# EAGLE design ESP03_Breakout (EAGLE 7.1.0)
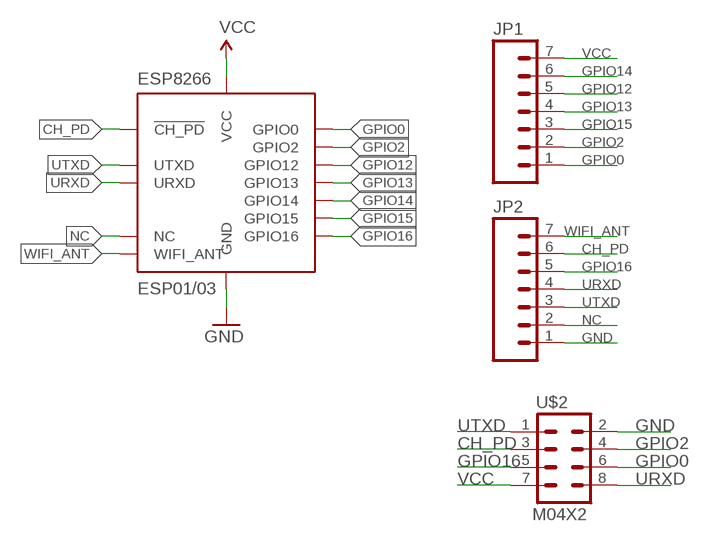
[diagram p0: schematic, sheet 1]

## Parts
ESP8266  ESP01/03  ESP-03SMD  [ESP-03]
JP1  M07  [1X07]
JP2  M07  [1X07]
U$2  M04X2  [2X4]

## Nets
CH_PD: ESP8266.CH_PD(!CH_PD) JP2.6 U$2.3
GND: ESP8266.GND JP2.1 U$2.2
GPIO0: ESP8266.GPIO0 JP1.1 U$2.6
GPIO2: ESP8266.GPIO2 JP1.2 U$2.4
GPIO12: ESP8266.GPIO12 JP1.5
GPIO13: ESP8266.GPIO13 JP1.4
GPIO14: ESP8266.GPIO14 JP1.6
GPIO15: ESP8266.GPIO15 JP1.3
GPIO16: ESP8266.GPIO16 JP2.5 U$2.5
NC: ESP8266.NC JP2.2
URXD: ESP8266.URXD JP2.4 U$2.8
UTXD: ESP8266.UTXD JP2.3 U$2.1
VCC: ESP8266.VCC JP1.7 U$2.7
WIFI_ANT: ESP8266.WIFI_ANT JP2.7

## Library data of the parts
ESP8266 = ESP8266:ESP-03: ESP-03 SMD package with built-in ceramic antenna. All available IOs.
JP1 JP2 = SparkFun-Connectors:M07: Header 7 Standard 7-pin 0.1" header. Use with straight break away headers (SKU : PRT-00116), right angle break away headers (PRT-00553), swiss pins (PRT-00743), machine pins (PRT-00117), and female headers (PRT-00115). NOTES ON THE VARIANTS LOCK and LOCK_LONGPADS... This footprint was designed to help hold the alignment of a through-hole component (i.e. 7-pin header) while soldering it into place. You may notice that each hole has been shifted either up or down by 0.005 of an inch from it's more standard position (which is usually a perfectly straight line). This slight alteration caused the pins (the squares in the middle) to touch the edges of the holes. Because they are alternating, it causes a "brace" to hold the header in place. 0.005 has proven to be the perfect amount of "off-center" position when using our standard breakaway headers. Although looks a little odd when you look at the bare footprint, once you have a header in there, the alteration is very hard to notice. Also, if you push a header all the way into place, it is covered up entirely on the bottom side. This idea of altering the position of holes to aid alignment will be further integrated into the Sparkfun Library for other footprints. It can help hold any component with 3 or more connection pins.
U$2 = SparkFun-Connectors:M04X2: .1" header, two rows of four.

## Board
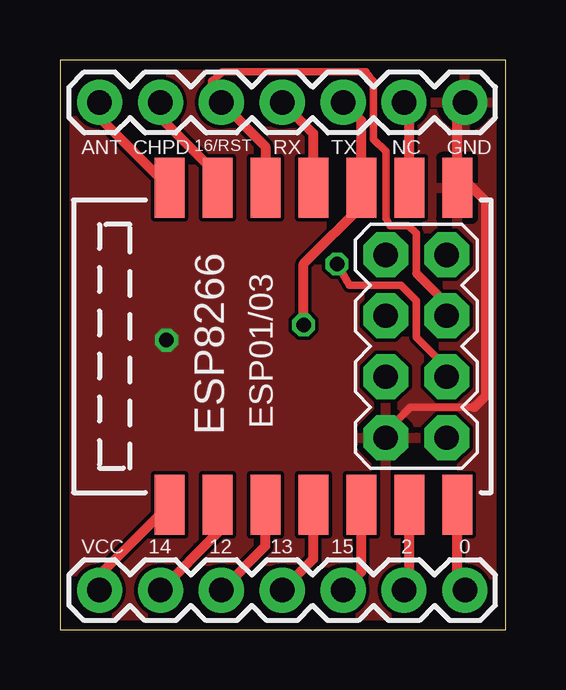
[diagram p1: board, top side]
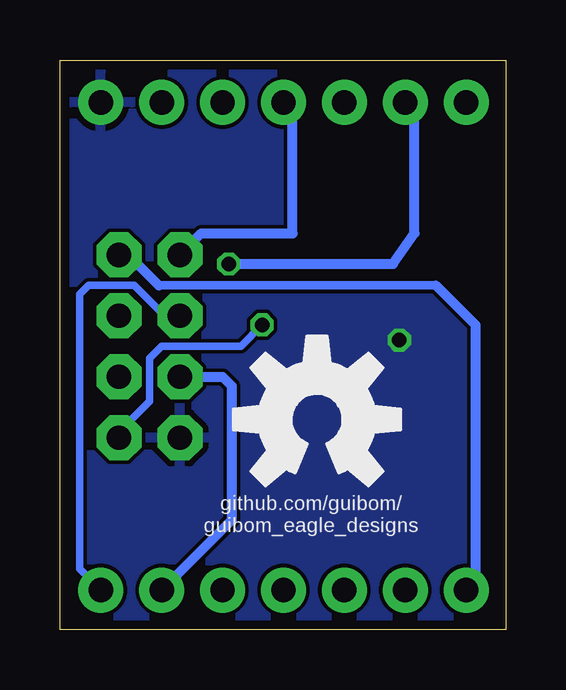
[diagram p2: board, bottom side, seen from below]

Size 18.59 x 23.74 mm. Coordinates in mm from the lower left corner, seen from the top.
Outline: 0,0 18.59,0 18.59,23.74 0,23.74 0,0
Copper layers (1*16): Top 0.0356mm / dielectric 1.5011mm / Bottom 0.0356mm
Design rules "LaenPCBOrder *": minimum track width 6mil, minimum drill 13mil, track to track 6mil, track to pad 6mil, pad to pad 6mil, via to via 6mil, smd to smd 6mil, copper to edge 15mil, drill to drill 6mil, minimum pad ring 7mil, minimum via ring 7mil, stop-mask expansion 3mil, vias tented up to drill 25mil, thermal gap 10mil

### Footprints (pad centres in the part's own frame; a part is rotated, then mirrored left to right if it is on the bottom)
ESP-03 = smd 1.25 x 2.5: CH_PD -2.7,6.6; GND 7.3,6.6; GPIO0 7.3,-6.6; GPIO2 5.3,-6.6; GPIO12 -0.7,-6.6; GPIO13 1.3,-6.6; GPIO14 -2.7,-6.6; GPIO15 3.3,-6.6; GPIO16 -0.7,6.6; NC 5.3,6.6; URXD 1.3,6.6; UTXD 3.3,6.6; VCC -4.7,-6.6; WIFI_ANT -4.7,6.6
1X07 = drill 1.016 pad 1.88: 1 0,0; 2 2.54,0; 3 5.08,0; 4 7.62,0; 5 10.16,0; 6 12.7,0; 7 15.24,0
2X4 = drill 1.016 pad 1.88 octagon: 1 -3.81,-1.27; 2 -3.81,1.27; 3 -1.27,-1.27; 4 -1.27,1.27; 5 1.27,-1.27; 6 1.27,1.27; 7 3.81,-1.27; 8 3.81,1.27

### Placement (x,y rotation side)
ESP8266  9.27,11.81 0 top
JP1  16.89,1.65 180 top
JP2  16.89,21.97 180 top
U$1  [OSHW-LOGO-L]  7.87,8.76 0 bottom
U$2  14.86,11.81 90 top

### Tracks (layer width: path | path; a pad name or v marks a point on that pad's centre or on a via)
CH_PD  (via drill 0.6)
  Top 0.305: 16.13,10.92 14.86,12.19 14.86,13.72 14.22,14.35 12.06,14.35 v11.56,15.24
  Top 0.406: JP2.6 4.19,21.34 6.35,19.18 6.35,18.63 ESP8266.CH_PD | U$2.3 16.13,10.92
  Bottom 0.406: v11.56,15.24 4.7,15.24 3.81,16.51 3.81,21.59 JP2.6
GND  (via drill 0.6)
  Top 0.305: 13.59,8.26 14.61,9.27 17.27,9.27
  Top 0.406: ESP8266.GND 16.57,19.05 | 16.57,19.05 16.57,21.65 JP2.1 | U$2.2 13.59,8.26 | 17.27,9.27 17.78,9.78 17.78,17.84 16.57,19.05
  other vias: 4.45,12.06
  pour Top: 0,24.13 0,0 19.05,0 19.05,24.13
  pour Bottom: -1.27,24.13 -1.27,-1.27 19.05,-1.27 19.05,24.13
GPIO0
  Top 0.406: JP1.1 16.57,1.97 ESP8266.GPIO0
  Bottom 0.305: U$2.6 14.22,13.08 15.49,14.35 17.4,14.35 17.78,13.97 17.78,2.54 JP1.1
GPIO2
  Top 0.406: JP1.2 14.57,1.87 ESP8266.GPIO2
  Bottom 0.406: U$2.4 11.81,10.54 11.43,10.16 11.43,4.57 JP1.2
GPIO12
  Top 0.406: JP1.5 8.57,3.49 ESP8266.GPIO12
GPIO13
  Top 0.406: JP1.4 10.57,2.95 ESP8266.GPIO13
GPIO14
  Top 0.406: JP1.6 6.57,4.03 ESP8266.GPIO14
GPIO15
  Top 0.406: JP1.3 12.57,2.41 ESP8266.GPIO15
GPIO16
  Top 0.305: 14.86,14.86 14.86,16.51 14.53,16.84 13.77,16.84 13.59,17.14 13.59,19.94 13.08,20.45 13.08,22.86 12.75,23.24 6.78,23.24 6.35,22.86
  Top 0.356: U$2.5 16.13,13.59 14.86,14.86 | 6.35,22.86 6.35,22.35 JP2.5
  Top 0.406: JP2.5 8.57,20.13 ESP8266.GPIO16
NC
  Top 0.406: ESP8266.NC 14.57,21.75 JP2.2
URXD
  Top 0.406: ESP8266.URXD 10.57,20.67 JP2.4
  Bottom 0.406: U$2.8 12.7,16.51 8.89,16.51 8.89,21.59 JP2.4
UTXD  (via drill 0.6)
  Top 0.406: JP2.3 12.57,21.21 ESP8266.UTXD 12.7,18.28 12.7,17.78 10.16,15.24 v10.16,12.7
  Bottom 0.305: 16.13,8.26 14.86,9.53 14.86,11.3 14.35,11.81 11.05,11.81 v10.16,12.7
  Bottom 0.406: U$2.1 16.13,8.26
VCC
  Top 0.406: JP1.7 1.65,2.29 ESP8266.VCC
  Bottom 0.356: 14.48,14.35 2.92,14.35
  Bottom 0.406: 14.48,14.35 15.75,15.62 U$2.7 | 2.92,14.35 1.27,12.7 1.27,2.03 JP1.7
WIFI_ANT
  Top 0.406: JP2.7 1.65,21.33 ESP8266.WIFI_ANT

### Text on the board
tPlace: ANT | CHPD | 16/RST | RX | TX | NC | GND | VCC | 14 | 12 | 13 | 15 | 2 | 0
bPlace: github.com/guibom/ / guibom_eagle_designs